# EAGLE design tracker_ (EAGLE 7.6.0)

## Sheet 1 of 2
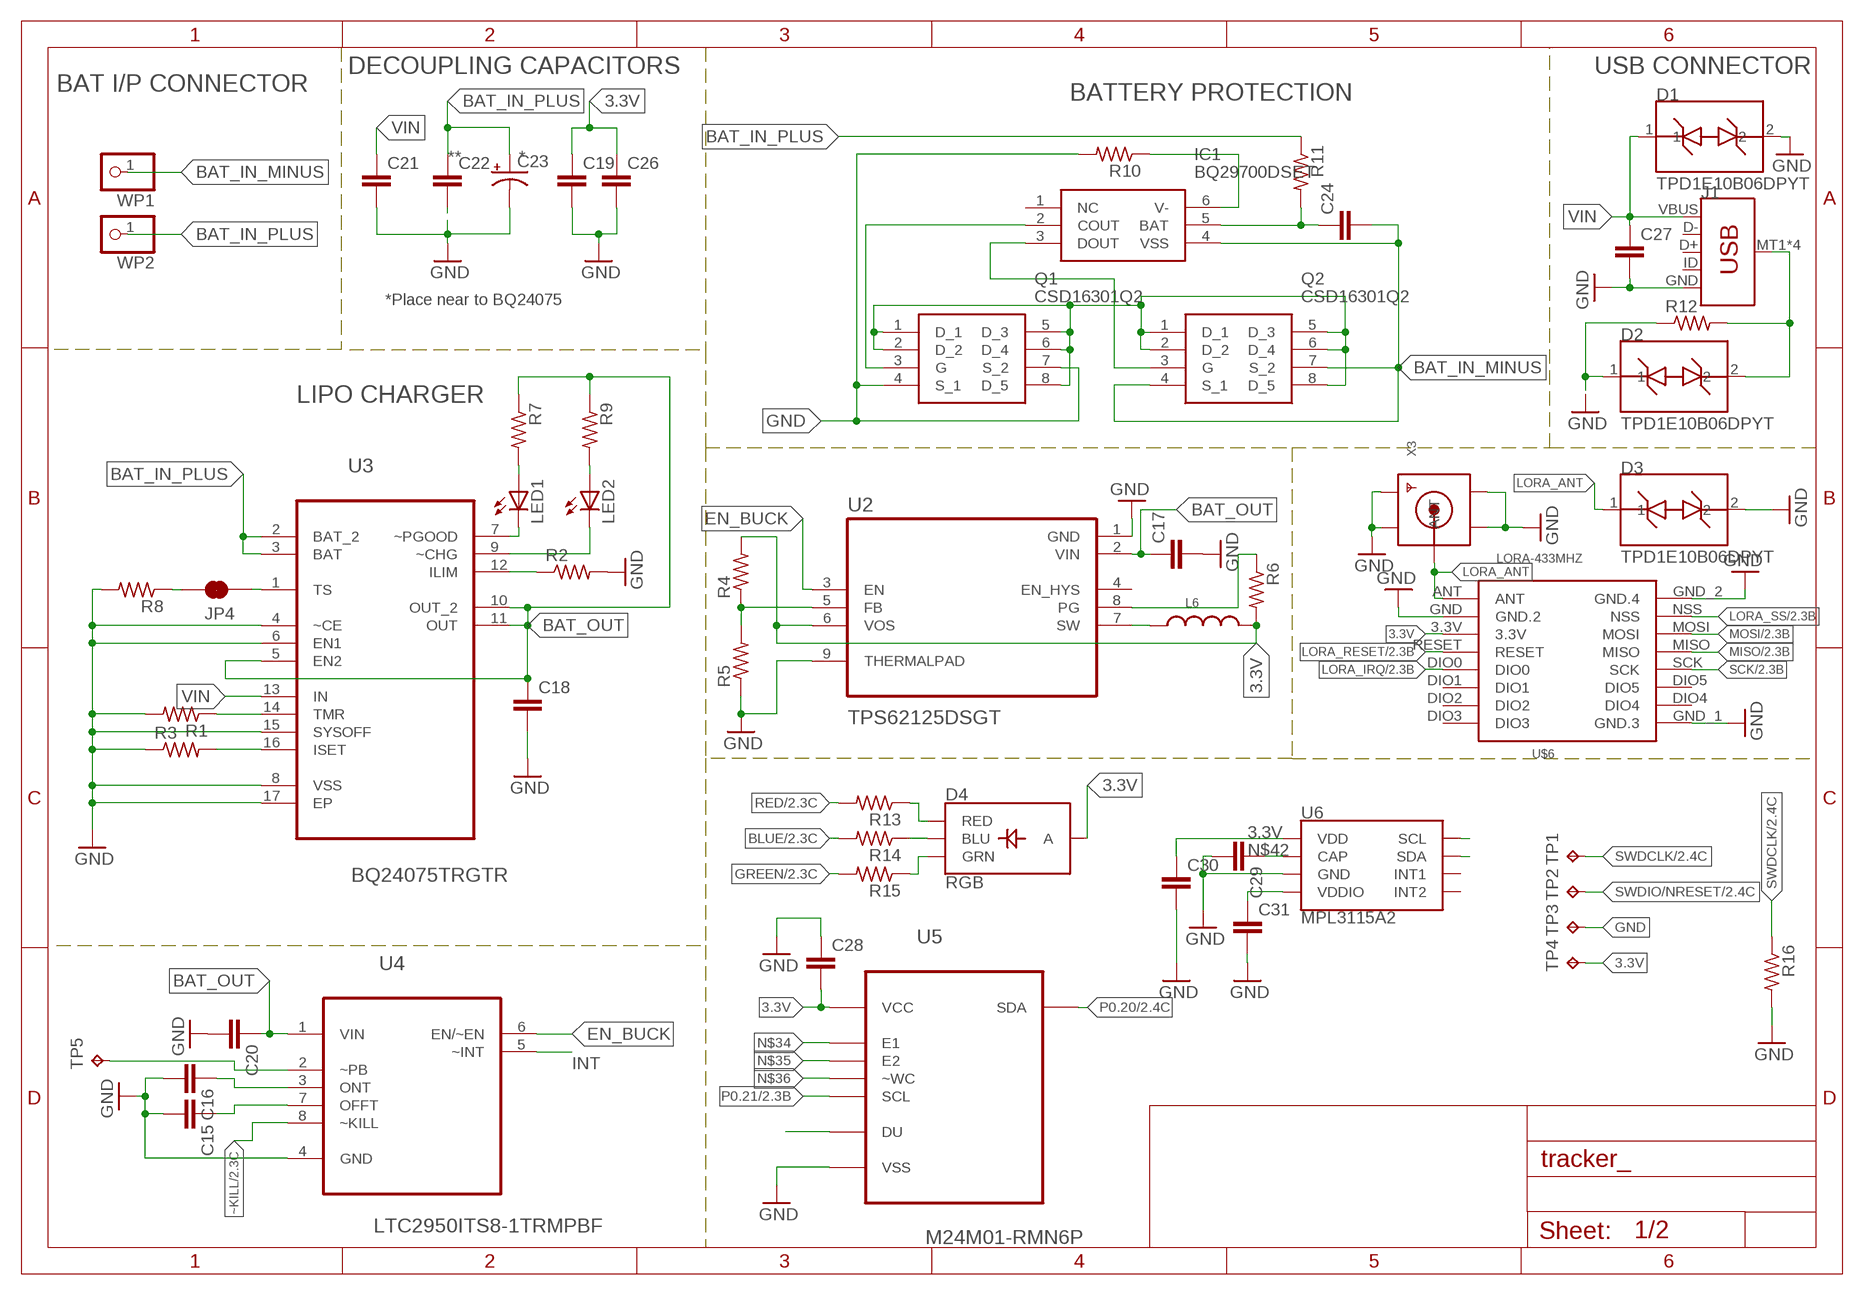
[diagram p0: schematic, sheet 1]

### Parts
C15  C-EUC0402  [C0402]
C16  C-EUC0402  [C0402]
C17  C-EUC0402  [C0402]
C18  C-EUC0402  [C0402]
C19  C-EUC0603  [C0603]
C20  C-EUC0402  [C0402]
C21  C-EUC0402  [C0402]
C22  C-EUC0805K  [C0805K]
C23  CPOL-USB/3528-21W  [B/3528-21W]
C24  C-EUC0603  [C0603]
C26  C-EUC0603  [C0603]
C27  C-EUC0603  [C0603]
C28  C-EUC0402  [C0402]
C29  C-EUC0402  [C0402]
C30  C-EUC0402  [C0402]
C31  C-EUC0402  [C0402]
D1  TPD1E10B06DPYT  [DFN100X60X45-2N]
D2  TPD1E10B06DPYT  [DFN100X60X45-2N]
D3  TPD1E10B06DPYT  [DFN100X60X45-2N]
D4  RGB  LED-RGB-CAPLCC  [P-LCC-4-3]
IC1  BQ29700DSET  [SON50P150X150X80-6N]
J1  USB_MICRO-B_SMT  [USB-MICROB]
JP4  JUMPER-SMT_2_NC_TRACE_SILK  [SMT-JUMPER_2_NC_TRACE_SILK]
L6  WE-GF_1210(M)_744764115  [WE-GF_1210]
LED1  LEDCHIPLED_0603  [CHIPLED_0603]
LED2  LEDCHIPLED_0603  [CHIPLED_0603]
Q1  CSD16301Q2  [CSD16301Q2]
Q2  CSD16301Q2  [CSD16301Q2]
R1  R-US_R0402  [R0402]
R2  R-US_R0402  [R0402]
R3  R-US_R0402  [R0402]
R4  R-US_R0402  [R0402]
R5  R-US_R0402  [R0402]
R6  R-US_R0402  [R0402]
R7  R-US_R0402  [R0402]
R8  R-US_R0402  [R0402]
R9  R-US_R0402  [R0402]
R10  R-US_R0402  [R0402]
R11  R-US_M0805  [M0805]
R12  R-US_R0402  [R0402]
R13  R-US_R0402  [R0402]
R14  R-US_R0402  [R0402]
R15  R-US_R0402  [R0402]
R16  R-US_R0402  [R0402]
TP1  TPB1,27  [B1,27]
TP2  TPB1,27  [B1,27]
TP3  TPB1,27  [B1,27]
TP4  TPB1,27  [B1,27]
TP5  TPB1,27  [B1,27]
U2  TPS62125DSGT  [SON50P200X200X80-9N]
U3  BQ24075TRGTR  [QFN50P300X300X100-17N]
U4  LTC2950ITS8-1TRMPBF  [SOT65P280X100-8N]
U5  M24M01-RMN6P  [SOIC127P600X175-8N]
U6  MPL3115A2  [LGA-8-5X3]
U$6  LORA-433MHZ  LORA-RA-01-433MHZ  [LORA-RA1-SMD]
WP1  WPAD-1-0805  [WPAD-1-0805]
WP2  WPAD-1-0805  [WPAD-1-0805]
X3  SMACONNECTOR_EDGE  [SMA_EDGELAUNCH]

### Nets
3.3V: C19.1 C26.1 C28.2 C30.1 D4.4(A) L6.2 R4.2 R6.2 TP4.TP U2.6(VOS) U5.8(VCC) U6.1(VDD) U$6.3.3V ; also sheet 2
BAT_IN_MINUS: C24.2 IC1.4(VSS) Q2.4(S_1) Q2.7(S_2) WP1.1
BAT_IN_PLUS [BAT]: C22.1 C23.+ R11.1 U3.2(BAT_2) U3.3(BAT) WP2.1
BAT_OUT [BAT]: C17.1 C18.1 C20.1 R7.1 R9.1 U2.2(VIN) U3.5(EN2) U3.10(OUT_2) U3.11(OUT) U4.1(VIN)
BLUE: R14.2 ; also sheet 2
DRAIN: Q1.1(D_1) Q1.2(D_2) Q1.5(D_3) Q1.6(D_4) Q1.8(D_5) Q2.1(D_1) Q2.2(D_2) Q2.5(D_3) Q2.6(D_4) Q2.8(D_5)
EN_BUCK: U2.3(EN) U4.6(EN/~EN)
GND: C15.2 C16.2 C17.2 C18.2 C19.2 C20.2 C21.2 C22.2 C23.- C26.2 C27.2 C28.1 C29.2 C30.2 C31.2 D1.2 D2.1 D3.2 J1.GND Q1.4(S_1) Q1.7(S_2) R1.2 R2.2 R3.1 R5.1 R8.2 R10.2 R12.1 R16.2 TP3.TP U2.1(GND) U2.9(THERMALPAD) U3.4(~CE) U3.6(EN1) U3.8(VSS) U3.15(SYSOFF) U3.17(EP) U4.4(GND) U5.4(VSS) U6.3(GND) U$6.GND(GND.2) U$6.GND_1(GND.3) U$6.GND_2(GND.4) X3.GND@1(GND4) X3.GND@2(GND3) X3.GND@3(GND2) X3.GND@4(GND1) ; also sheet 2
GREEN: R15.2 ; also sheet 2
INT: U4.5(~INT)
LORA_ANT: D3.1 U$6.ANT X3.P(ANT)
LORA_IRQ: U$6.DIO0 ; also sheet 2
LORA_RESET: U$6.RESET ; also sheet 2
LORA_SS: U$6.NSS ; also sheet 2
MISO: U$6.MISO ; also sheet 2
MOSI: U$6.MOSI ; also sheet 2
N$8: R1.1 U3.14(TMR)
N$11: R3.2 U3.16(ISET)
N$12: R2.1 U3.12(ILIM)
N$13: R4.1 R5.2 U2.5(FB)
N$14: LED1.C U3.7(~PGOOD)
N$15: LED2.C U3.9(~CHG)
N$16: LED1.A R7.2
N$17: LED2.A R9.2
N$18: IC1.2(COUT) Q1.3(G)
N$19: IC1.3(DOUT) Q2.3(G)
N$20: D2.2 J1.MT1(SHIELD) J1.MT2(SHIELD) J1.P$1(SHIELD) J1.P$2(SHIELD) R12.2
N$21: D4.1(RED) R13.1
N$22: R6.1 U2.8(PG)
N$24: JP4.1 U3.1(TS)
N$25: D4.3(BLU) R14.1
N$26: JP4.2 R8.1
N$27: IC1.6(V-) R10.1
N$28: C16.1 U4.3(ONT)
N$29: C15.1 U4.7(OFFT)
N$30: C24.1 IC1.5(BAT) R11.2
N$31: D4.2(GRN) R15.1
N$33: TP5.TP U4.2(~PB)
N$34: U5.2(E1)
N$35: U5.3(E2)
N$36: U5.7(~WC)
N$38: U5.1(DU)
N$42: C29.1 U6.2(CAP)
N$44: C31.1 U6.4(VDDIO)
P0.20: U5.5(SDA) U6.7(SDA) ; also sheet 2
P0.21: U5.6(SCL) U6.8(SCL) ; also sheet 2
RED: R13.2 ; also sheet 2
SCK: U$6.SCK ; also sheet 2
SW [3.3V]: L6.1 U2.7(SW)
SWDCLK: R16.1 TP1.TP ; also sheet 2
SWDIO/NRESET: TP2.TP ; also sheet 2
VIN [VIN]: C21.1 C27.1 D1.1 J1.VBUS U3.13(IN)
~KILL: U4.8(~KILL) ; also sheet 2
Unconnected: IC1.1(NC) J1.D+ J1.D- J1.ID U2.4(EN_HYS) U6.5(INT2) U6.6(INT1) U$6.DIO1 U$6.DIO2 U$6.DIO3 U$6.DIO4 U$6.DIO5

### Notes on the sheet
- DECOUPLING CAPACITORS | USB CONNECTOR
- BAT I/P CONNECTOR
- BATTERY PROTECTION
- ** | *
- *Place near to BQ24075
- LIPO CHARGER

## Sheet 2 of 2
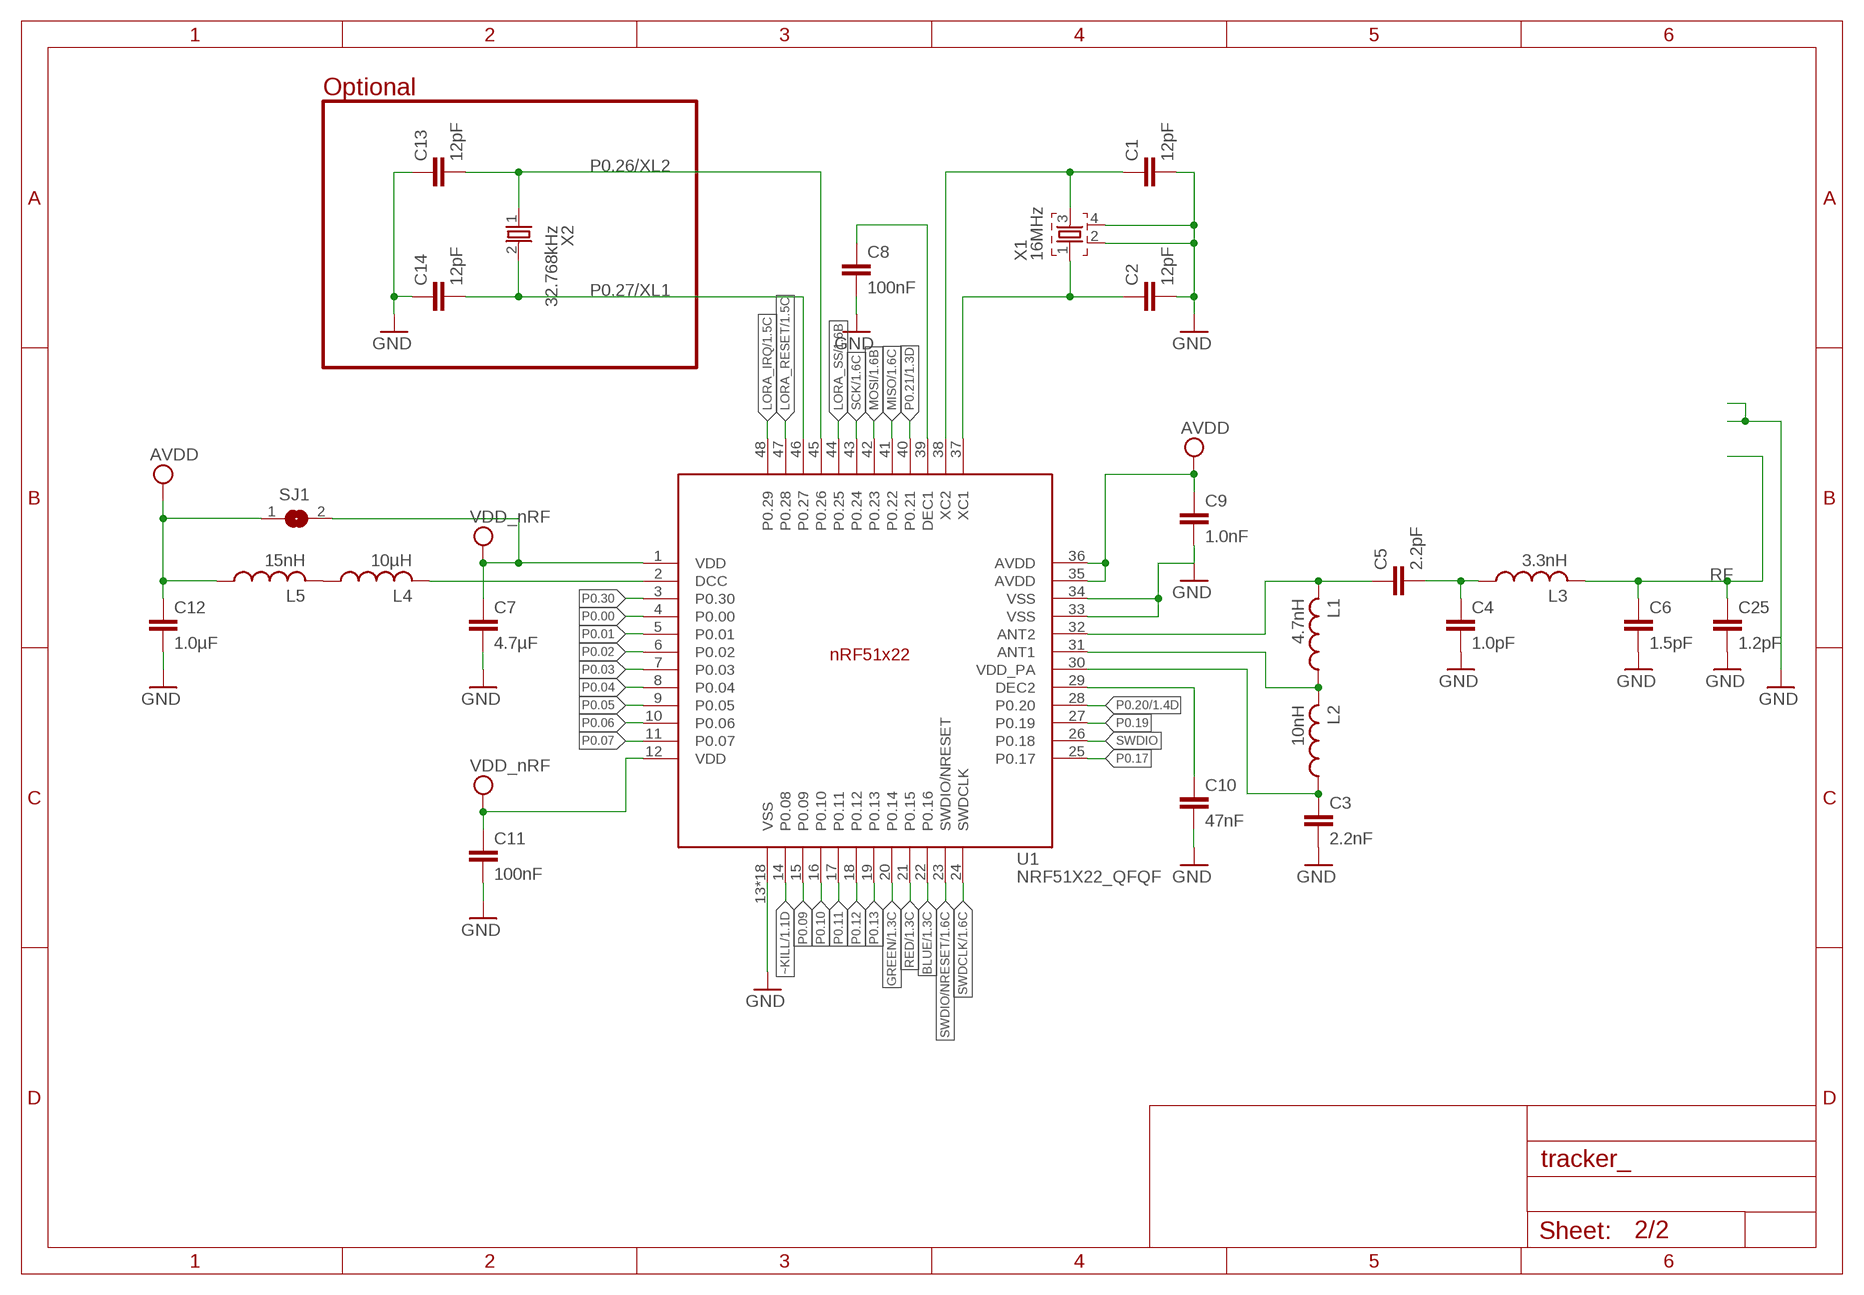
[diagram p1: schematic, sheet 2]

### Parts
C1  12pF  CAPACITOR_0402_N  [RESC0402_N]
C2  12pF  CAPACITOR_0402_N  [RESC0402_N]
C3  2.2nF  CAPACITOR_0402_N  [RESC0402_N]
C4  1.0pF  CAPACITOR_0402_N  [RESC0402_N]
C5  2.2pF  CAPACITOR_0402_N  [RESC0402_N]
C6  1.5pF  CAPACITOR_0402_N  [RESC0402_N]
C7  4.7µF  CAPACITOR_0603_N  [RESC0603_N]
C8  100nF  CAPACITOR_0402_N  [RESC0402_N]
C9  1.0nF  CAPACITOR_0402_N  [RESC0402_N]
C10  47nF  CAPACITOR_0402_N  [RESC0402_N]
C11  100nF  CAPACITOR_0402_N  [RESC0402_N]
C12  1.0µF  CAPACITOR_0603_N  [RESC0603_N]
C13  12pF  CAPACITOR_0402_N  [RESC0402_N]
C14  12pF  CAPACITOR_0402_N  [RESC0402_N]
C25  1.2pF  CAPACITOR_0402_N  [RESC0402_N]
L1  4.7nH  INDUCTOR_0402_N  [RESC0402_N]
L2  10nH  INDUCTOR_0402_N  [RESC0402_N]
L3  3.3nH  INDUCTOR_0402_N  [RESC0402_N]
L4  10µH  INDUCTOR_0603_N  [RESC0603_N]
L5  15nH  INDUCTOR_0402_N  [RESC0402_N]
SJ1  SJ  [SJ]
U1  NRF51X22_QFQF  [QFN40P600X600X90-48_N]
X1  16MHz  XTAL_32MHZ  [BT-XTAL_2016_N]
X2  32.768kHz  XTAL_32KHZ  [XTAL_3215_N]

### Nets
3.3V: C7.1 C11.1 SJ1.2 U1.1(VDD) U1.12(VDD) ; supply symbol labelled VDD_nRF ; also sheet 1
AVDD: C9.1 C12.1 L5.1 SJ1.1 U1.35(AVDD) U1.36(AVDD)
BLUE: U1.22(P0.16) ; also sheet 1
GND: C1.2 C2.2 C3.2 C4.2 C6.2 C7.2 C8.2 C9.2 C10.2 C11.2 C12.2 C13.1 C14.1 C25.2 U1.13(VSS) U1.33(VSS) U1.34(VSS) U1.PAD(VSS) U1.PAD@VIA01(VSS) U1.PAD@VIA02(VSS) U1.PAD@VIA03(VSS) U1.PAD@VIA04(VSS) U1.PAD@VIA05(VSS) U1.PAD@VIA06(VSS) U1.PAD@VIA07(VSS) U1.PAD@VIA08(VSS) U1.PAD@VIA09(VSS) U1.PAD@VIA10(VSS) U1.PAD@VIA11(VSS) U1.PAD@VIA12(VSS) U1.PAD@VIA13(VSS) U1.PAD@VIA14(VSS) U1.PAD@VIA15(VSS) U1.PAD@VIA16(VSS) X1.2 X1.4 ; also sheet 1
GREEN: U1.20(P0.14) ; also sheet 1
LORA_IRQ: U1.48(P0.29) ; also sheet 1
LORA_RESET: U1.47(P0.28) ; also sheet 1
LORA_SS: U1.44(P0.25) ; also sheet 1
MISO: U1.41(P0.22) ; also sheet 1
MOSI: U1.42(P0.23) ; also sheet 1
N$1: L1.1 L2.2 U1.31(ANT1)
N$2: L4.1 L5.2
N$3: C1.1 U1.38(XC2) X1.3
N$4: L4.2 U1.2(DCC)
N$5: C10.1 U1.29(DEC2)
N$6: C8.1 U1.39(DEC1)
N$7: C3.1 L2.1 U1.30(VDD_PA)
N$9: C5.1 L1.2 U1.32(ANT2)
N$10: C4.1 C5.2 L3.1
P0.00: U1.4(P0.00)
P0.01: U1.5(P0.01)
P0.02: U1.6(P0.02)
P0.03: U1.7(P0.03)
P0.04: U1.8(P0.04)
P0.05: U1.9(P0.05)
P0.06: U1.10(P0.06)
P0.07: U1.11(P0.07)
P0.09: U1.15(P0.09)
P0.10: U1.16(P0.10)
P0.11: U1.17(P0.11)
P0.12: U1.18(P0.12)
P0.13: U1.19(P0.13)
P0.17: U1.25(P0.17)
P0.19: U1.27(P0.19)
P0.20: U1.28(P0.20) ; also sheet 1
P0.21: U1.40(P0.21) ; also sheet 1
P0.26/XL2: C13.2 U1.45(P0.26) X2.1
P0.27/XL1: C14.2 U1.46(P0.27) X2.2
P0.30: U1.3(P0.30)
RED: U1.21(P0.15) ; also sheet 1
RF: C6.1 C25.1 L3.2
SCK: U1.43(P0.24) ; also sheet 1
SWDCLK: U1.24(SWDCLK) ; also sheet 1
SWDIO: U1.26(P0.18)
SWDIO/NRESET: U1.23(SWDIO/NRESET) ; also sheet 1
X1: C2.1 U1.37(XC1) X1.1
~KILL: U1.14(P0.08) ; also sheet 1

### Notes on the sheet
- Optional

## Library data of the parts
C1-C14 C25 = Nordic_nRF:CAPACITOR: Generic chip capacitor
C15-C22 C24 C26-C31 = rcl_:C-EU: CAPACITOR, European symbol
C23 = rcl_:CPOL-US: POLARIZED CAPACITOR, American symbol
D1-D3 = TPD1E10B06DPYT:TPD1E10B06DPYT: Single Channel ESD in 0402 package with 10pF Capacitance and 6V Breakdown 2-X1SON -40 to 125; AVAILABILITY: Unavailable; DESCRIPTION: Single-Channel ESD in 0402 Package With 10pF Capacitance and 6V Breakdown 2-X1SON -40 to 125; MF: Texas Instruments; MP: TPD1E10B06DPYT; PACKAGE: XDFN-2 Texas Instruments; PRICE: None
D4 = SparkFun-LED:LED-RGB-CA: LED-RGB Diffused Common Anode Packages: LED RGB-THRU P-LCC-4-3 LED-TRICOLOR-SMD SparkFun Products: RGB Diffused Common Anode- Diffuse <[https://www.sparkfun.com/products/10821]> RGB Diffused Common Anode - Clear <[https://www.sparkfun.com/products/10820]> Qduino Mini <[https://www.sparkfun.com/products/13614]> Triple Output LED RGB - SMD <https://www.sparkfun.com/products/7844>; PROD_ID: DIO-12986
IC1 = BQ29700DSET:BQ29700DSET: Texas Instruments BQ29700DSET, Battery Charger Lithium-Ion, Lithium-Polymer, 6-Pin WSON Source: Datasheet <http://www.ti.com/lit/ds/symlink/bq2970.pdf>; ARROW_PART_NUMBER: BQ29700DSET; ARROW_PRICE-STOCK: https://www.arrow.com/en/products/bq29700dset/texas-instruments; DESCRIPTION: Texas Instruments BQ29700DSET, Battery Charger Lithium-Ion, Lithium-Polymer, 6-Pin WSON; HEIGHT: 0.8mm; MANUFACTURER_NAME: Texas Instruments; MANUFACTURER_PART_NUMBER: BQ29700DSET; RS_PART_NUMBER: 1456841; RS_PRICE-STOCK: http://uk.rs-online.com/web/p/products/1456841
J1 = SparkFun-Connectors:USB_MICRO-B: USB Type Micro-B Connector Male/female and PTH/SMT variants SparkFun Products: SparkFun microB USB Breakout <https://www.sparkfun.com/products/12035> SparkFun USB microB Plug Breakout <https://www.sparkfun.com/products/10031> SparkFun ESP8266 Thing <https://www.sparkfun.com/products/13231>; PROD_ID: CONN-09505; SF_ID: PRT-08533
JP4 = SparkFun-Jumpers:JUMPER-SMT_2_NC_TRACE: Normally closed trace jumper This jumper has a trace between two pads so it's normally closed (NC). Use a razor knife to open the connection. For best results follow the IPC guidelines for cutting traces: Cutout at least 0.063 mm (0.005 in). Remove all loose material to clean up the cut area. Seal the cut with an approved epoxy. Reapply solder to reclose the connection.
L1-L5 = Nordic_nRF:INDUCTOR: Generic chip inductor
L6 = Eagle_AECQ_PRODUCTS (rev17d):WE-GF_1210(M): SMD Wire Wound Inductor Characteristics Wire wound on ferrite Operating temperature: –40 °C to +105 °C High resistance against dampness Applications RF circuits like tuner, transponder etc. RF amplifier circuits like antennas amplifier Oscillator Filter circuits Amplification circuits <http://katalog.we-online.de/media/images/v2/Family_WE-GF_SMD-HF.jpg> Details see: http://katalog.we-online.de/en/pbs/WE-GF? Updated by Dan Xu 2014-05-19 2014 (C) Wurth Elektronik; WE-NUMBER: 744764115/15uH
LED1 LED2 = adafruit:LED: LED OSRAM: - CHIPLED LG R971, LG N971, LY N971, LG Q971, LY Q971, LO R971, LY R971 LH N974, LH R974 LS Q976, LO Q976, LY Q976 LO Q996 - Hyper CHIPLED LW Q18S LB Q993, LB Q99A, LB R99A - SideLED LS A670, LO A670, LY A670, LG A670, LP A670 LB A673, LV A673, LT A673, LW A673 LH A674 LY A675 LS A676, LA A676, LO A676, LY A676, LW A676 LS A679, LY A679, LG A679 - Hyper Micro SIDELED® LS Y876, LA Y876, LO Y876, LY Y876 LT Y87S - SmartLED LW L88C, LW L88S LB L89C, LB L89S, LG L890 LS L89K, LO L89K, LY L89K LS L896, LA L896, LO L896, LY L896 - TOPLED LS T670, LO T670, LY T670, LG T670, LP T670 LSG T670, LSP T670, LSY T670, LOP T670, LYG T670 LG T671, LOG T671, LSG T671 LB T673, LV T673, LT T673, LW T673 LH T674 LS T676, LA T676, LO T676, LY T676, LB T676, LH T676, LSB T676, LW T676 LB T67C, LV T67C, LT T67C, LS T67K, LO T67K, LY T67K, LW E67C LS E67B, LA E67B, LO E67B, LY E67B, LB E67C, LV E67C, LT E67C LW T67C LS T679, LY T679, LG T679 LS T770, LO T770, LY T770, LG T770, LP T770 LB T773, LV T773, LT T773, LW T773 LH T774 LS E675, LA E675, LY E675, LS T675 LS T776, LA T776, LO T776, LY T776, LB T776 LHGB T686 LT T68C, LB T68C - Hyper Mini TOPLED® LB M676 - Mini TOPLED Santana® LG M470 LS M47K, LO M47K, LY M47K Source: http://www.osram.convergy.de/
Q1 Q2 = CSD16301Q2:CSD16301Q2: Texas Instruments CSD16301Q2 N-channel MOSFET Transistor, 5 A, 25 V, 6-Pin SON Source: Datasheet <http://www.farnell.com/datasheets/2060288.pdf>; ARROW_PART_NUMBER: CSD16301Q2; ARROW_PRICE-STOCK: https://www.arrow.com/en/products/csd16301q2/texas-instruments; DESCRIPTION: Texas Instruments CSD16301Q2 N-channel MOSFET Transistor, 5 A, 25 V, 6-Pin SON; HEIGHT: mm; MANUFACTURER_NAME: Texas Instruments; MANUFACTURER_PART_NUMBER: CSD16301Q2; RS_PART_NUMBER: 1628525; RS_PRICE-STOCK: http://uk.rs-online.com/web/p/products/1628525
R1-R16 = rcl_:R-US_: RESISTOR, American symbol
SJ1 = jumper:SJ: SMD solder JUMPER
TP1-TP5 = testpad:TP: Test pad
U1 = Nordic_nRF:NRF51X22_QF: nRF51x22 For devices: nRF51422 nRF51822 Features Single chip, highly flexible, 2.4 GHz multi-protocol device 32-bit ARM Cortex M0 CPU core 256kB/128kB flash + 32kB/16kB RAM Supports Bluetooth low energy protocol stacks Thread safe and run-time protected Event driven API On air compatible with nRF24L series 3 data rates (2Mbps/1Mbps/250kbps) +4dBm output power -93dBm sensitivity, Bluetooth low energy PPI system for maximum power-efficient applications and code simplification Flexible power management system with automatic power management of each peripheral Configurable I/O mapping for analog and digital I/O Applications Mobile phone accessories Wearables Beacons Rezence wireless charging monitoring PC peripherals Consumer Electronics (CE) remote controls Proximity/Alert sensors Smart Home Sports, fitness and healthcare sensors Smart RF tags Toys and electronic games Intelligent domestic appliances Industrial and commercial sensors Lighting
U2 = TPS62125DSGT:TPS62125DSGT: None; AVAILABILITY: Unavailable; DESCRIPTION: 3V-17V, 300mA Buck Converter With Adjustable Enable Threshold And Hysteresis 8-WSON -40 to 85; MF: Texas Instruments; MP: TPS62125DSGT; PACKAGE: WSON-8 Texas Instruments; PRICE: None
U3 = Texas_Instruments:BQ24075TRGTR: 1.5A USB-Friendly Li-Ion Battery Charger and Power-Path Management IC; MPN: BQ24075TRGTR; OC_FARNELL: -; OC_NEWARK: 63R9855; PACKAGE: QFN-16; SUPPLIER: Texas Instruments
U4 = LTC:LTC2950ITS8-1TRMPBF: Push Button On/Off Controller; MPN: LTC2950ITS8-1#TRMPBF; OC_FARNELL: 1671439; OC_NEWARK: 12P6555; PACKAGE: TSOT-23-8; SUPPLIER: Linear Technology
U5 = ST_Microelctronics:M24M01-RMN6P: 1 Mbit serial I²C bus EEPROM; MPN: M24M01-RMN6P; OC_FARNELL: 1670817; OC_NEWARK: 19P1132; PACKAGE: SOIC-8; SUPPLIER: STMICROELECTRONICS
U6 = SparkFun-Sensors:MPL3115A2: NXP MPL3115A2 Digital Altimeter/Pressure Sensor The MPL3115A2 is a compact piezoresistive absolute pressure sensor with an I2C interface. MPL3115 has a wide operating range of 20kPa to 110 kPa, a range that covers all surface elevations on Earth. The fully internally compensated MEMS in conjunction with an embedded high resolution 24-bit equivalent ADC provide accurate pressure [Pascals] /altitude [meters] and temperature [degrees Celsius] data. Datasheet <http://cdn.sparkfun.com/datasheets/Sensors/Pressure/MPL3115A2.pdf> SparkFun Products SparkFun Altitude/Pressure Sensor Breakout - MPL3115A2 <https://www.sparkfun.com/products/11084> (SEN-11084) SparkFun Weather Shield <https://www.sparkfun.com/products/12081> (DEV-12081) SparkFun Photon Weather Shield <https://www.sparkfun.com/products/13630> (DEV-13630); PROD_ID: IC-10869
U$6 = LikeCircuit:LORA-RA-01-433MHZ
WP1 WP2 = PatternAgents-ProtoPads:WPAD-1: Wire Pad - Single Good for scope lead clips, test jumpers, probe points, etc. PatternAgents ProtoPads Library Schematic and PCB layout libraries for design patterns by PatternAgents. For the CADSoft Eagle CAD program : http://www.cadsoftusa.com/download-eagle/ Source LBR : http://www.patternagents.com Github : https://github.com/PatternAgents License : http://creativecommons.org/licenses/by-sa/4.0/ (Creative Commons 4.0) THIS SOFTWARE IS PROVIDED BY THE CONTRIBUTORS "AS IS" AND WITHOUT ANY EXPRESS OR IMPLIED WARRANTIES, INCLUDING, BUT NOT LIMITED TO, THE IMPLIED WARRANTIES OF MERCHANTABILITY AND FITNESS FOR A PARTICULAR PURPOSE ARE DISCLAIMED. IN NO EVENT SHALL THE COPYRIGHT OWNER OR CONTRIBUTORS BE LIABLE FOR ANY DIRECT, INDIRECT, INCIDENTAL, SPECIAL, EXEMPLARY, OR CONSEQUENTIAL DAMAGES (INCLUDING, BUT NOT LIMITED TO, PROCUREMENT OF SUBSTITUTE GOODS OR SERVICES; LOSS OF USE, DATA, OR PROFITS; OR BUSINESS INTERRUPTION) HOWEVER CAUSED AND ON ANY THEORY OF LIABILITY, WHETHER IN CONTRACT, STRICT LIABILITY, OR TORT (INCLUDING NEGLIGENCE OR OTHERWISE) ARISING IN ANY WAY OUT OF THE USE OF THIS SOFTWARE, EVEN IF ADVISED OF THE POSSIBILITY OF SUCH DAMAGE.; BOM: EXCLUDE
X1 = Nordic_nRF:XTAL_32MHZ
X2 = Nordic_nRF:XTAL_32KHZ
X3 = adafruit:SMACONNECTOR: SMA Connector 90° DIP SMA Connector, 50 Ohm (4UConnector: 07259)

## Net classes
1 3.3V: clearance 0.203 mm
2 BAT: clearance 0.254 mm
3 VIN: clearance 0.508 mm

## Board
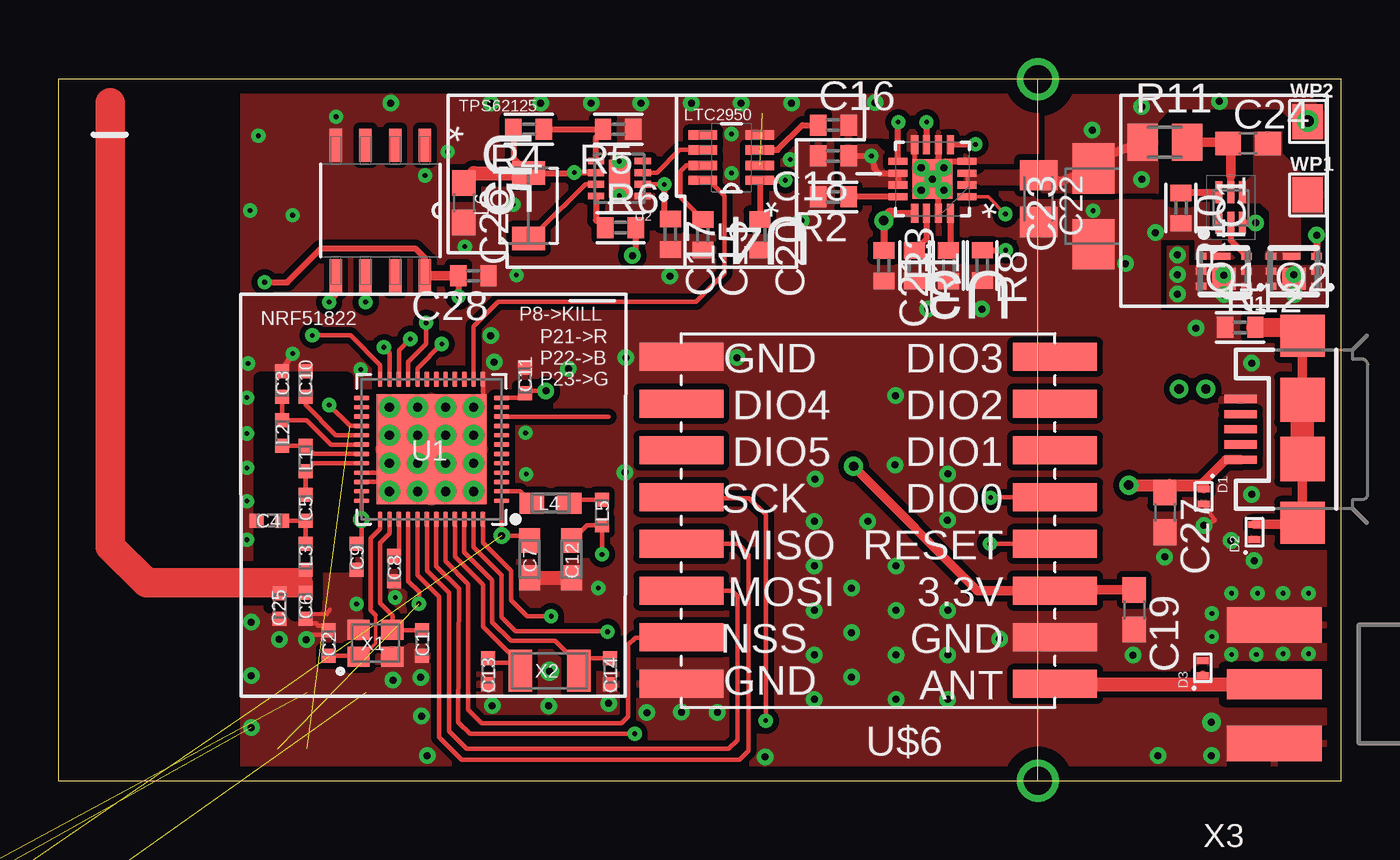
[diagram p2: board, top side]
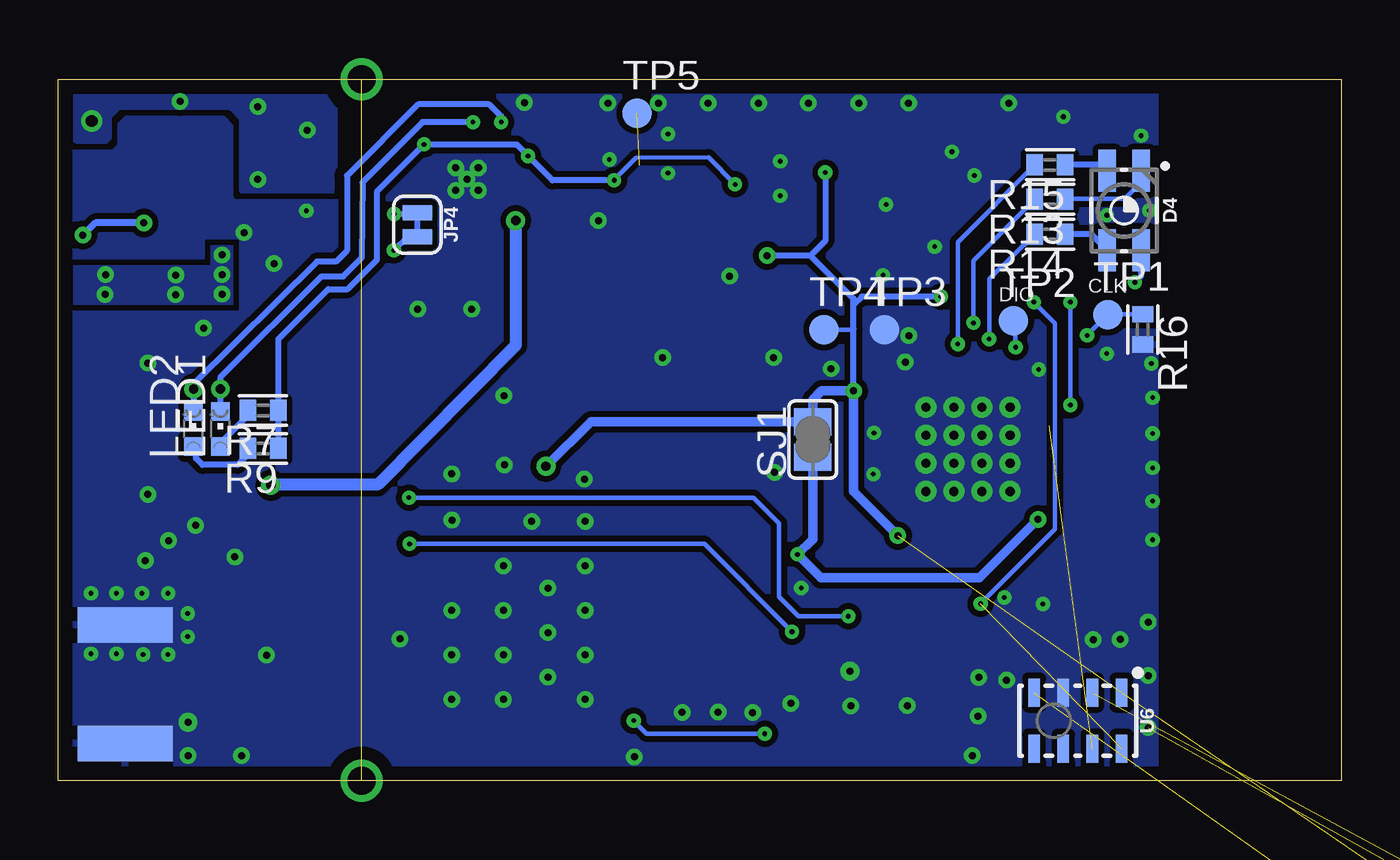
[diagram p3: board, bottom side, seen from below]

Size 54.95 x 30.02 mm. Coordinates in mm from the lower left corner, seen from the top.
Outline: 0,0 54.95,0 54.95,30.02 0,30.02 0,0
Copper layers (1*16): Top 0.035mm / dielectric 1.5mm / Bottom 0.035mm
Design rules "default *": minimum track width 8mil, minimum drill 0.2mm, track to track 4mil, track to pad 4mil, pad to pad 4mil, via to via 4mil, smd to smd 4mil, copper to edge 24mil, drill to drill 6mil, minimum pad ring 10mil, minimum via ring 8mil, stop-mask expansion 4mil, vias tented up to drill 40mil, thermal gap 0mil
tRestrict: area 36.6,25.1 to 36.6,26; area 37,24.8 to 37.9,24.9; area 38.3,25.1 to 38.4,26; area 8.6,9.6 to 12.4,17.2; area 12.8,12.9 to 13.2,13; area 10.9,9.2 to 12.5,9.9; area 10.1,7.1 to 10.3,8; area 10.1,9.1 to 10.3,9.9; area 20.7,9 to 21.5,9.4; area 9,7.4 to 11,7.8; area 7.9,7.8 to 11.1,9.1; area 50,3.4 to 54.2,4.9; area 40.9,28.9 to 43.1,31.1; area 40.8,-1.1 to 43.1,1.1
bRestrict: area 41.3,25 to 42.7,25.3; area 40.8,-1.1 to 43.1,1.1; area 40.9,28.9 to 43.1,31.1

### Footprints (pad centres in the part's own frame; a part is rotated, then mirrored left to right if it is on the bottom)
RESC0402_N = smd 0.6 x 0.6: 1 -0.55,0; 2 0.55,0
RESC0603_N = smd 1.05 x 0.9: 1 -0.8,0; 2 0.8,0
C0402 = smd 0.7 x 0.9: 1 -0.65,0; 2 0.65,0
C0603 = smd 1.1 x 1: 1 -0.85,0; 2 0.85,0
C0805K = smd 1.3 x 1.6: 1 -1,0; 2 1,0
B/3528-21W = smd 2.15 x 1.8: + 1.625,0; - -1.625,0
DFN100X60X45-2N = smd 0.28 x 0.52: 1 -0.325,0; 2 0.325,0
P-LCC-4-3 = smd 1.8 x 0.75: 1 -1.7,0.725; 2 -1.7,-0.725; 3 1.7,-0.725; 4 1.7,0.725
SON50P150X150X80-6N = smd 0.95 x 0.3: 1 -0.65,0.5; 2 -0.65,0; 3 -0.65,-0.5; 4 0.65,-0.5; 5 0.65,0; 6 0.65,0.5
USB-MICROB = smd 1.4 x 0.35: D+ -2.65,0; D- -2.65,-0.65; GND -2.65,1.3; ID -2.65,0.65; VBUS -2.65,-1.3 | smd 1.9 x 1.8: MT1 0,-4; MT2 0,4 | smd 1.9 x 1.9: P$1 0,-1.27; P$2 0,1.27
SMT-JUMPER_2_NC_TRACE_SILK = smd 0.635 x 1.27: 1 -0.508,0; 2 0.508,0
WE-GF_1210 = smd 1 x 1.4: 1 -1.4,0; 2 1.4,0
CHIPLED_0603 = smd 0.8 x 0.8: A 0,-0.75; C 0,0.75
CSD16301Q2 = smd 0.45 x 0.3: 1 -0.975,0.65; 2 -0.975,0; 3 -0.975,-0.65; 4 0.975,-0.65; 5 0.975,0; 6 0.975,0.65 | smd 0.75 x 0.3: 7 0.095,-0.65 | smd 1 x 0.95: 8 0,0.325
R0402 = smd 0.7 x 0.9: 1 -0.65,0; 2 0.65,0
M0805 = smd 1.3 x 1.6: 1 -0.95,0; 2 0.95,0
SJ = smd 1.168 x 1.6: 1 -0.762,0; 2 0.762,0
B1,27 = smd 1.27 x 1.27: TP 0,0
QFN40P600X600X90-48_N = smd 0.65 x 0.2: 1 -3,2.2; 2 -3,1.8; 3 -3,1.4; 4 -3,1; 5 -3,0.6; 6 -3,0.2; 7 -3,-0.2; 8 -3,-0.6; 9 -3,-1; 10 -3,-1.4; 11 -3,-1.8; 12 -3,-2.2; 25 3,-2.2; 26 3,-1.8; 27 3,-1.4; 28 3,-1; 29 3,-0.6; 30 3,-0.2; 31 3,0.2; 32 3,0.6; 33 3,1; 34 3,1.4; 35 3,1.8; 36 3,2.2 | smd 0.2 x 0.65: 13 -2.2,-3; 14 -1.8,-3; 15 -1.4,-3; 16 -1,-3; 17 -0.6,-3; 18 -0.2,-3; 19 0.2,-3; 20 0.6,-3; 21 1,-3; 22 1.4,-3; 23 1.8,-3; 24 2.2,-3; 37 2.2,3; 38 1.8,3; 39 1.4,3; 40 1,3; 41 0.6,3; 42 0.2,3; 43 -0.2,3; 44 -0.6,3; 45 -1,3; 46 -1.4,3; 47 -1.8,3; 48 -2.2,3 | smd 4.7 x 4.7: PAD 0,0 | drill 0.4: PAD@VIA01 -1.8,1.8; PAD@VIA02 -1.8,0.6; PAD@VIA03 -1.8,-0.6; PAD@VIA04 -1.8,-1.8; PAD@VIA05 -0.6,1.8; PAD@VIA06 -0.6,0.6; PAD@VIA07 -0.6,-0.6; PAD@VIA08 -0.6,-1.8; PAD@VIA09 0.6,1.8; PAD@VIA10 0.6,0.6; PAD@VIA11 0.6,-0.6; PAD@VIA12 0.6,-1.8; PAD@VIA13 1.8,1.8; PAD@VIA14 1.8,0.6; PAD@VIA15 1.8,-0.6; PAD@VIA16 1.8,-1.8
SON50P200X200X80-9N = smd 0.71 x 0.27: 1 -1.005,0.75; 2 -1.005,0.25; 3 -1.005,-0.25; 4 -1.005,-0.75; 5 1.005,-0.75; 6 1.005,-0.25; 7 1.005,0.25; 8 1.005,0.75 | smd 0.9 x 1.6: 9 0,0
QFN50P300X300X100-17N = smd 0.813 x 0.305: 1 -1.473,0.762; 2 -1.473,0.254; 3 -1.473,-0.254; 4 -1.473,-0.762; 9 1.473,-0.762; 10 1.473,-0.254; 11 1.473,0.254; 12 1.473,0.762 | smd 0.305 x 0.813: 5 -0.762,-1.473; 6 -0.254,-1.473; 7 0.254,-1.473; 8 0.762,-1.473; 13 0.762,1.473; 14 0.254,1.473; 15 -0.254,1.473; 16 -0.762,1.473 | smd 1.702 x 1.702: 17 0,0
SOT65P280X100-8N = smd 1.219 x 0.406: 1 -1.219,0.965; 2 -1.219,0.33; 3 -1.219,-0.33; 4 -1.219,-0.965; 5 1.219,-0.965; 6 1.219,-0.33; 7 1.219,0.33; 8 1.219,0.965
SOIC127P600X175-8N = smd 1.422 x 0.533: 1 -2.794,1.905; 2 -2.794,0.635; 3 -2.794,-0.635; 4 -2.794,-1.905; 5 2.794,-1.905; 6 2.794,-0.635; 7 2.794,0.635; 8 2.794,1.905
LGA-8-5X3 = smd 1.2 x 0.5: 1 -1.2,1.875; 2 -1.2,0.625; 3 -1.2,-0.625; 4 -1.2,-1.875; 5 1.2,-1.875; 6 1.2,-0.625; 7 1.2,0.625; 8 1.2,1.875
LORA-RA1-SMD = smd 3.6 x 1.2: 3.3V -8,3; ANT -8,7; DIO0 -8,-1; DIO1 -8,-3; DIO2 -8,-5; DIO3 -8,-7; DIO4 8,-5; DIO5 8,-3; GND -8,5; GND_1 8,-7; GND_2 8,7; MISO 8,1; MOSI 8,3; NSS 8,5; RESET -8,1; SCK 8,-1
WPAD-1-0805 = smd 1.3 x 1.5: 1 -0.015,0
BT-XTAL_2016_N = smd 0.95 x 0.85: 1 -0.725,-0.575; 2 0.725,-0.575; 3 0.725,0.575; 4 -0.725,0.575
XTAL_3215_N = smd 1 x 1.8: 1 -1.25,0; 2 1.25,0
SMA_EDGELAUNCH = smd 4.064 x 1.524: GND@1 2.032,-2.54; GND@2 2.032,2.54 | smd 4.064 x 1.524 bottom: GND@3 2.032,2.54; GND@4 2.032,-2.54 | smd 4.064 x 1.27: P 2.032,0

### Placement (x,y rotation side)
C1  15.58,5.88 270 top
C2  11.58,5.88 90 top
C3  9.58,16.98 90 top
C4  9.04,11.13 180 top
C5  10.58,11.68 270 top
C6  10.58,7.48 270 top
C7  20.18,9.48 270 top
C8  14.38,9.08 270 top
C9  12.79,9.58 270 top
C10  10.58,16.98 90 top
C11  19.98,17.13 90 top
C12  21.98,9.48 270 top
C13  18.41,4.68 90 top
C14  23.64,4.68 90 top
C15  27.61,23.37 270 top
C16  33.2,28.07 0 top
C17  26.21,23.39 270 top
C18  33.2,26.75 180 top
C19  46.08,7.32 270 top
C20  30.05,23.37 270 top
C21  35.36,22.05 270 top
C22  41.99,24.92 270 top
C23  44.32,24.59 90 top
C24  50.95,27.28 0 top
C25  9.49,7.48 270 top
C26  17.37,24.74 270 top
C27  47.4,11.48 270 top
C28  17.78,21.62 180 top
C29  -17.98,-12.04 0 top  (outside the outline)
C30  -17.98,-15.39 0 top  (outside the outline)
C31  -17.98,-18.75 0 top  (outside the outline)
D1  49.06,12.17 270 top
D2  51.23,10.64 90 top
D3  49.02,4.83 90 top
D4  9.3,24.41 270 bottom
IC1  50.22,24.54 90 top
J1  53.29,15.04 0 top
JP4  39.57,23.8 270 bottom
L1  10.58,13.78 270 top
L2  9.58,14.88 270 top
L3  10.58,9.58 270 top
L4  21.09,11.88 180 top
L5  23.29,11.48 90 top
L6  20.14,24.61 90 top
LED1  48.01,15.05 0 bottom
LED2  49.16,15.05 0 bottom
Q1  49.92,21.81 180 top
Q2  52.92,21.81 180 top
R1  36.68,22.05 270 top
R2  33.2,24.99 180 top
R3  38.13,22.05 90 top
R4  20.14,27.89 180 top
R5  23.98,27.89 180 top
R6  24.08,23.67 0 top
R7  46.18,15.85 180 bottom
R8  39.57,22.06 270 top
R9  46.18,14.22 180 bottom
R10  48.08,24.51 270 top
R11  47.4,27.33 0 top
R12  50.62,19.41 0 top
R13  12.47,24.89 180 bottom
R14  12.47,23.39 180 bottom
R15  12.47,26.37 180 bottom
R16  8.5,19.32 270 bottom
SJ1  22.63,14.61 90 bottom
TP1  9.99,19.95 0 bottom
TP2  14.03,19.68 0 bottom
TP3  19.57,19.3 0 bottom
TP4  22.15,19.3 0 bottom
TP5  30.15,28.57 0 bottom
U1  15.98,14.18 180 top
U2  24.03,25.78 180 top
U3  37.44,25.76 180 top
U4  28.83,26.67 180 top
U5  13.79,24.41 270 top
U6  11.28,2.57 270 bottom
U$6  34.69,11.14 180 top
WP1  53.52,25.08 0 top
WP2  53.52,28.22 0 top
X1  13.58,5.88 0 top
X2  21.04,4.71 0 top
X3  54.11,4.13 180 top

### Tracks (layer width: path | path; a pad name or v marks a point on that pad's centre or on a via)
3.3V  (via drill 0.2, 0.3, 0.4)  (2 unrouted)
  Top 0.2: U1.12 19.88,16.38 C11.1 19.98,16.68 v20.88,16.68 | U1.1 v18.98,10.48 19.98,10.48 C7.1
  Top 0.254: U2.6 22.25,26.03 v22.1,26.04 22.08,26.01 L6.2 19.49,26.66 R4.2 | R6.2 24.73,22.62 v24.59,22.48 | C28.2 17.14,21.6 v17.14,20.73 | v8.84,21.34 9.8,21.34 11.25,22.78 15.29,22.78 15.7,22.38 U5.8
  Top 0.406: v34.06,13.46 39.36,8.14 U$6.3.3V 42.72,8.17 C19.1 | U5.8 C28.2
  Top 0.61: C26.1 17.8,26.01 L6.2
  Bottom 0.203: TP4.TP 20.92,19.3 20.88,19.34
  Bottom 0.254: v22.1,26.04 22.1,23.11 22.73,22.48 | 22.73,22.48 v24.59,22.48 | v20.88,16.68 20.88,19.34 20.88,20.37 | 20.88,20.37 20.88,20.63 22.73,22.48 | v17.14,20.73 20.53,20.73 20.88,20.37 | D4.4 8.57,21.6 v8.84,21.34
  Bottom 0.4: v20.88,16.68 20.88,12.38 v18.98,10.48
  Bottom 0.406: v20.88,16.68 22.25,16.68 22.63,16.31 SJ1.2 32.13,15.37 v34.06,13.46
ANT3
  Top 1.27: 10.27,8.46 3.78,8.46 2.22,10.02 2.22,29.02
AVDD  (via drill 0.2, 0.3)
  Top 0.2: C12.1 22.63,10.93 L5.1 v23.28,9.68 | U1.36 v12.98,11.18 12.98,10.33 C9.1
  Top 0.203: U1.35 U1.36
  Bottom 0.4: v12.98,11.18 15.48,8.68 22.28,8.68 v23.28,9.68
  Bottom 0.406: SJ1.1 22.63,10.34 v23.28,9.68
BAT_IN_MINUS
  pour Top: 51.71,22.31 53.17,22.31 53.17,24.13 53.33,24.26 54.15,24.26 54.15,25.91 53.33,25.91 52.37,26.86 52.37,27.75 51.23,27.75 51.23,25.97 50.85,25.59 50.66,25.59 50.66,24.77 51.49,24.77 51.9,24.35 51.9,22.82 51.71,22.63
BAT_IN_PLUS  (via drill 0.3, 0.5)
  Top 0.102: U3.2 U3.3
  Top 0.406: R11.1 43.64,26.31 C23.+ 42.91,25.64 C22.1
  Top 0.813: R11.1 46.35,27.37
  other vias: 44.28,27.85 46.41,28.85 49.73,29.08 53.52,28.24 46.41,25.74
  pour Top (isolate 0.406): 38.56,26.11 41.99,26.11 42.29,26.42 42.29,29.36 53.51,29.36 54.31,28.56 54.31,27.57 54.14,27.55 54.05,27.52 52.97,27.52 52.91,28.19 52.32,28.78 47.62,28.78 47.07,28.22 47.07,25.17 42.16,25.2 41.92,25.53 38.56,25.53
  pour Bottom (isolate 0.406): 43.08,25.25 47.07,25.25 47.07,28.32 47.57,28.83 52.37,28.83 52.78,28.42 52.78,27.53 52.93,27.38 54.15,27.38 54.23,27.46 54.23,29.26 54.2,29.29 43.36,29.29 43.1,29.03 43.1,25.27
BAT_OUT  (via drill 0.2)
  Top 0.203: U2.2 25.47,25.53 v25.96,25.53
  Top 0.254: U3.5 v39.28,27.24 | C18.1 v34.82,26.75 34.95,26.21 35.15,26.01 U3.10 U3.11 | v31.14,25.7 U4.1 C20.1 | C17.1 25.96,24.3 v25.96,25.53
  Bottom 0.203: v25.96,25.53 27.1,26.7 30.2,26.67 31.14,25.73 v31.14,25.7
  Bottom 0.254: v31.14,25.7 33.78,25.7 v34.82,26.75 35.32,27.24 v39.28,27.24 41.31,25.21 41.31,22.29 42.54,21.04 43.38,21.04 45.53,18.9 R7.1 R9.1
  pour Top (isolate 0.254): 33.53,27.2 35.05,27.2 35.33,26.92 35.33,26.26 35.51,26.09 36.27,26.09 36.27,25.43 35.1,25.43 34.47,24.79 33.53,24.79
BLUE  (via drill 0.2)
  Top 0.203: v15.07,18.91 14.58,18.42 U1.22
  Bottom 0.203: R14.2 15.07,21.49 v15.07,18.91
DRAIN  (via drill 0.3)
  other vias: 49.91,21.64 52.92,21.67 47.93,20.83 47.93,21.67 47.93,22.5 49.92,20.8 52.95,20.82
  pour Top: 54.28,20.45 47.52,20.45 47.52,22.86 48.39,22.86 48.39,22.02 54.28,22.02
  pour Bottom: 47.5,22.89 48.39,22.89 48.39,22.02 54.28,22.02 54.28,20.42 47.5,20.42
EN_BUCK
  Top 0.203: U2.3 25.64,26.03 26.61,27 U4.6
GND  (via drill 0.2, 0.2 pad 0.13, 0.3, 0.3 pad 0.8)  (3 unrouted)
  Top 0.2: U1.PAD@VIA04 18.18,15.98 U1.13 | U1.34 14.18,12.78 U1.PAD@VIA13 | U1.33 13.78,13.18 U1.PAD@VIA14 | U1.PAD@VIA04 U1.PAD@VIA16 U1.PAD@VIA13 | U1.PAD@VIA04 U1.PAD@VIA01 U1.PAD@VIA13 | U1.PAD@VIA06 15.98,13.58 U1.PAD | 11.58,6.63 11.13,6.63 11.03,6.73 10.58,6.73 | 11.48,6.23 10.86,6.23 v10.62,6.04 | 10.63,7.13 11.5,7.12 11.61,7.32
  Top 0.203: U3.8 36.68,26.52 v36.96,26.24 | D1.2 49.53,11.15 v49.07,10.93
  Top 0.254: C3.2 v10.04,18.28 | 36.91,26.01 v36.96,26.24 | 37.92,26.31 v37.92,26.24 | v37.92,26.24 37.92,26.01 37.44,26.01 U3.17 | v37.92,26.24 37.97,26.52 U3.4 | U3.6 37.69,26.29 v37.92,26.24 | U3.15 37.69,25.22 v37.92,25.27
  Top 0.61: C7.2 C12.2
  other vias: 8.27,2.26 15.56,2.76 22.82,29.01 20.66,29.01 18.53,29.01 14.23,29.01 34.99,29.03 31.4,29.01 27.11,29.01 29.25,29.01 24.95,29.01 49.39,2.5 47.1,1.07 9.46,6.05 36.96,25.27 49.39,1.07 23.13,8.25 12.77,7.56 14.43,7.84 14.34,4.3 18.59,3.21 18.67,17.91 21.85,17.63 18.52,19.06 26.19,21.6 39.55,20.19 24.26,13.2 21.04,4.68 15.52,4.42 15.8,1.07 31.81,23.98 28.83,27.69 24.03,25.04 46.99,23.46 45.71,22.14 8.08,11.97 8.08,14.86 8.27,6.78 8.27,4.5 37.44,25.76 44.32,24.4 24.03,26.52 8.08,10.31 30.28,1.02 25.21,2.91 24.31,18.11 28.83,26.01 31.34,26.59 23.57,3.3 28.23,2.92 21.01,3.2 26.68,2.93 38.09,11.15 32.41,12.9 38.1,13.13 35.86,16.48 29.06,18.11 40.31,6.07 32.38,11.1 32.38,9.19 32.38,7.29 32.38,5.38 32.38,3.48 33.97,8.24 33.97,6.34 33.97,4.43 35.88,9.19 38.1,7.29 38.1,5.38 38.1,3.48 51.11,17.87 47.39,9.58 51.22,9.41 50.22,10.28 35.88,7.29 35.88,5.38 35.88,3.48 34.67,11.1 37.24,20.19 48.72,19.37 51.11,12.26 46.03,5.38 53.55,8.02 52.46,8.02 51.36,8.02 50.25,8.02 49.41,7.15 49.41,6.16 53.55,5.43 52.46,5.43 51.31,5.4 50.25,5.4 35.84,13.51 17.41,22.86 19.62,21.64 8.22,24.41 11.9,28.43 8.57,27.61 8.13,17.86 12.95,17.6 15.71,25.91 10.03,24.21 16.67,26.93 19.49,24.67 20.01,14.89 20.04,13.12 8.08,13.39 8.08,16.4
  pour Top (isolate 0.254, rank 2): 55.3,30.23 55.3,-0.47 7.96,-0.47 7.96,30.23
  pour Bottom (isolate 0.254, rank 2): 56.06,30.68 56.06,-0.47 7.96,-0.45 7.96,30.73
  cutout Top: 18.18,16.38 18.18,11.98 13.79,11.98 13.79,16.38
GREEN  (via drill 0.2)
  Top 0.203: 15.39,17.19 U1.20 15.38,17.66 v16.42,18.69
  Bottom 0.203: R15.2 16.42,23.04 v16.42,18.69
LORA_ANT
  Top 0.406: D3.1 49.02,4.13 49.12,4.13
  Top 0.61: U$6.ANT 42.7,4.13 49.12,4.13 X3.P
LORA_IRQ  (via drill 0.2)
  Top 0.2: U1.48 18.18,10.18 19.38,8.98 19.38,7.72
  Top 0.203: v39.93,12.12 39.95,12.14 U$6.DIO0 | 19.38,7.72 20.07,7.04 v21.11,7.04
  Bottom 0.203: v39.93,12.12 25.17,12.12 24.08,11.02 24.08,7.87 23.24,7.04 v21.11,7.04
LORA_RESET  (via drill 0.2)
  Top 0.2: U1.47 17.78,9.98 18.98,8.78 18.98,6.98 19.58,6.38
  Top 0.203: 19.58,6.38 23.51,6.38 v23.52,6.38 | v39.9,10.13 v39.91,10.14 U$6.RESET
  Bottom 0.203: v23.52,6.38 27.28,10.13 v39.9,10.13
LORA_SS
  Top 0.2: U1.44 16.58,9.38 17.56,8.41
  Top 0.203: U$6.NSS arc-90 26.67,6.12 24.71,6.12 24.41,5.82 24.41,2.74 24.13,2.46 18.13,2.46 17.56,3.04 17.56,8.41
MISO
  Top 0.2: U1.41 15.38,8.78 16.31,7.86
  Top 0.203: U$6.MISO 29.1,10.14 29.57,9.68 29.57,1.27 29.18,0.89 17.27,0.89 16.31,1.85 16.31,7.86
MOSI
  Top 0.2: U1.42 15.78,8.98 16.73,8.04
  Top 0.203: U$6.MOSI 26.7,8.13 28.85,8.13 29.08,7.9 29.08,1.73 28.7,1.37 17.47,1.37 16.73,2.12 16.73,8.04
N$1
  Top 0.2: U1.31 10.93,13.98 L1.1 L2.2
N$2
  Top 0.2: L5.2 21.88,12.03 L4.1
N$3
  Top 0.2: U1.38 14.18,10.58 13.78,10.18 13.78,7.58 14.31,7.06 X1.3 14.33,6.43 C1.1
N$4
  Top 0.2: U1.2 19.78,12.38 L4.2
N$5
  Top 0.2: U1.29 11.88,14.78 10.58,16.08 C10.1
N$6
  Top 0.2: U1.39 14.58,9.83 C8.1
N$7
  Top 0.2: C3.1 L2.1 10.63,15.43 11.68,14.38 U1.30
N$8
  Top 0.254: U3.14 37.19,23.2 R1.1
N$9
  Top 0.2: U1.32 10.93,13.58 L1.2 C5.1
N$10
  Top 0.2: C4.1 C5.2 L3.1
N$11
  Top 0.254: U3.16 38.2,22.77 R3.2
N$12
  Top 0.254: U3.12 R2.1
N$13
  Top 0.254: U2.5 23.02,27.53 R5.2 R4.1
N$14  (via drill 0.2, 0.4)
  Top 0.254: v37.19,28.19 U3.7
  Bottom 0.254: v37.19,28.19 39.34,28.19 41.92,25.62 41.95,22.39 42.75,21.59 43.68,21.59 48.01,17.26 v48.01,16.76 LED1.C
N$15  (via drill 0.2, 0.4)
  Top 0.254: U3.9 35.97,28.31 v35.98,28.19
  Bottom 0.254: v35.98,28.19 35.98,28.45 36.49,28.96 39.53,28.96 42.58,25.91 42.58,22.7 43.05,22.23 43.87,22.23 49.15,16.99 v49.15,16.76 49.15,15.81 LED2.C
N$16
  Bottom 0.254: 48.01,14.47 LED1.A 48.01,14.45 46.83,15.63 R7.2
N$17
  Bottom 0.254: R9.2 46.83,13.96 47.27,13.51 48.77,13.51 49.05,13.79 49.05,14.29 LED2.A
N$18
  Top 0.254: IC1.2 50.22,23.14 Q1.3
N$19  (via drill 0.3)
  Top 0.305: IC1.3 51.4,23.89 v51.28,23.88 | v53.9,23.36 53.91,22.47 Q2.3
  Bottom 0.305: v51.28,23.88 53.37,23.88 v53.9,23.36
N$20
  Top 0.254: 53.22,10.97 J1.MT1
  Top 0.406: J1.MT2 J1.P$2 | J1.P$1 J1.MT1 | D2.2 53.22,10.97
  Top 0.813: R12.2 52.92,19.41 J1.MT2
  Top 1.016: J1.P$2 J1.P$1
N$21
  Bottom 0.203: 8.57,25.67 8.57,25.59 9.26,24.91 11.81,24.91 R13.1
  Bottom 0.254: R13.1 11.82,24.77 | 8.57,25.67 D4.1
N$22
  Top 0.254: U2.8 23.02,24 R6.1
N$24  (via drill 0.2 pad 0.13)
  Top 0.152: U3.1 39.83,24.99 v40.56,24.26
  Bottom 0.254: JP4.1 39.57,24.26 v40.56,24.26
N$25
  Bottom 0.254: D4.3 10.71,23.39 R14.1
N$26  (via drill 0.2 pad 0.13)
  Top 0.254: v40.58,22.71 40.25,22.71 R8.1
  Bottom 0.254: JP4.2 39.99,23.29 v40.58,22.71
N$27
  Top 0.305: R10.1 48.14,25.19 IC1.6
N$28
  Top 0.254: U4.3 30.81,27 31.88,28.07 C16.1
N$29
  Top 0.203: U4.7 26.9,26.34 26.64,26.09 26.64,24.98 C15.1
N$30
  Top 0.305: IC1.5 50.22,25.91
  Top 0.406: R11.2 50.05,27.33 C24.1 50.22,27.17 50.22,25.91
N$31
  Bottom 0.254: D4.2 10.02,26.36 R15.1
N$33  (1 unrouted)
N$37  (via drill 1.2)  (1 unrouted)
  other vias: 41.96,30.02 41.96,0
N$42  (1 unrouted)
N$44  (1 unrouted)
P0.06
  Top 0.2: U1.10 23.57,15.58
P0.20  (via drill 0.2)  (1 unrouted)
  Top 0.203: 11.89,21.14 U5.5 11.89,20.78 v11.59,20.48 | U1.28 12.49,15.18 v11.59,16.08
  Bottom 0.203: v11.59,16.08 v11.59,20.48
P0.21  (via drill 0.2)  (1 unrouted)
  Top 0.2: U1.40 14.98,8.53
  Top 0.203: 14.98,8.53 15.44,8.07 v15.44,7.57 | v13.16,20.48 U5.6
  Bottom 0.203: v13.16,20.48 12.26,19.58 12.26,10.76 v15.44,7.57
P0.26/XL2
  Top 0.2: U1.45 16.98,9.58 18.18,8.38 18.18,6.58 19.38,5.38 19.38,5.03 | X2.1 19.38,5.03 | 19.38,5.03 18.58,5.03 arc-90 C13.2
P0.27/XL1
  Top 0.2: U1.46 17.38,9.78 18.58,8.58 18.58,6.78 19.38,5.98 21.28,5.98 22.23,5.03 X2.2 22.23,5.23 C14.2
RED  (via drill 0.2)
  Top 0.203: U1.21 14.98,17.93 15.75,18.69 v15.75,19.6
  Bottom 0.203: R13.2 15.75,22.27 v15.75,19.6
RF
  Top 0.2: 10.73,9.03 10.78,8.98
  Top 0.305: C25.1 C6.1 L3.2 10.73,9.03
SCK  (via drill 0.2)
  Top 0.2: U1.43 16.18,9.18 17.16,8.21
  Top 0.203: 28.17,11.63 U$6.SCK 26.73,12.09 29.59,12.09 30.3,11.38 v30.3,2.56 | v24.69,2.01 17.63,2.01 17.13,2.5 17.16,8.21
  Bottom 0.203: v30.3,2.56 29.74,2.01 v24.69,2.01
SW
  Top 0.203: U2.7 22.57,25.53 20.57,23.53 20.46,23.53 L6.1
SWDCLK  (via drill 0.2)
  Top 0.203: v10.88,19.06 12.51,19.06 13.79,17.78 13.79,17.19 U1.24
  Bottom 0.203: v10.88,19.06 TP1.TP 9.98,19.97 R16.1
SWDIO/NRESET  (via drill 0.2)
  Top 0.203: U1.23 14.18,18.31 v13.94,18.55
  Bottom 0.203: v13.94,18.55 13.94,19.67 TP2.TP
VIN  (via drill 0.4)
  Top 0.203: J1.VBUS 50.6,13.74
  Top 0.305: 35.66,24.28 U3.13 | v35.36,23.98 C21.1
  Top 0.406: J1.VBUS 50.01,13.74 49.02,12.75 49.02,12.65 49.02,12.53 D1.1
  Top 0.508: v45.85,12.65 47.6,12.65 | 47.6,12.65 49.02,12.65 | v35.36,23.98 35.66,24.28 | C27.1 47.68,12.57 47.6,12.65
  Bottom 0.305: 45.82,12.68 v45.85,12.65
  Bottom 0.508: 45.82,12.68 41.27,12.68 35.36,18.64 v35.36,23.98
X1
  Top 0.15: X1.1 13.13,5.58 13.28,5.58 13.58,5.88 13.58,7.08
  Top 0.2: U1.37 13.78,10.78 13.38,10.38 13.38,7.28 13.58,7.08 | C2.1 12.83,5.33 X1.1
~KILL
  Top 0.2: U1.14 17.78,19.46
  Top 0.203: U4.8 27.86,25.7 28.52,25.04 28.52,21.72 27.3,20.5 18.83,20.5 17.78,19.46

### Text on the board
tPlace: TPS62125 | LTC2950 | NRF51822 | P8->KILL | P21->R / P22->B / P23->G
bPlace: CLK | DIO